# EAGLE design keypad connector (EAGLE 8.2.1)
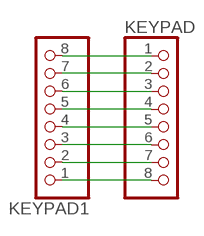
[diagram p0: schematic, sheet 1]

## Parts
KEYPAD  PINHD-1X8  [1X08]
KEYPAD1  PINHD-1X8  [1X08]

## Nets
N$1: KEYPAD1.8 KEYPAD.1
N$2: KEYPAD1.7 KEYPAD.2
N$3: KEYPAD1.6 KEYPAD.3
N$4: KEYPAD1.5 KEYPAD.4
N$5: KEYPAD1.4 KEYPAD.5
N$6: KEYPAD1.3 KEYPAD.6
N$7: KEYPAD1.2 KEYPAD.7
N$8: KEYPAD1.1 KEYPAD.8

## Library data of the parts
KEYPAD KEYPAD1 = pinhead:PINHD-1X8: PIN HEADER

## Board
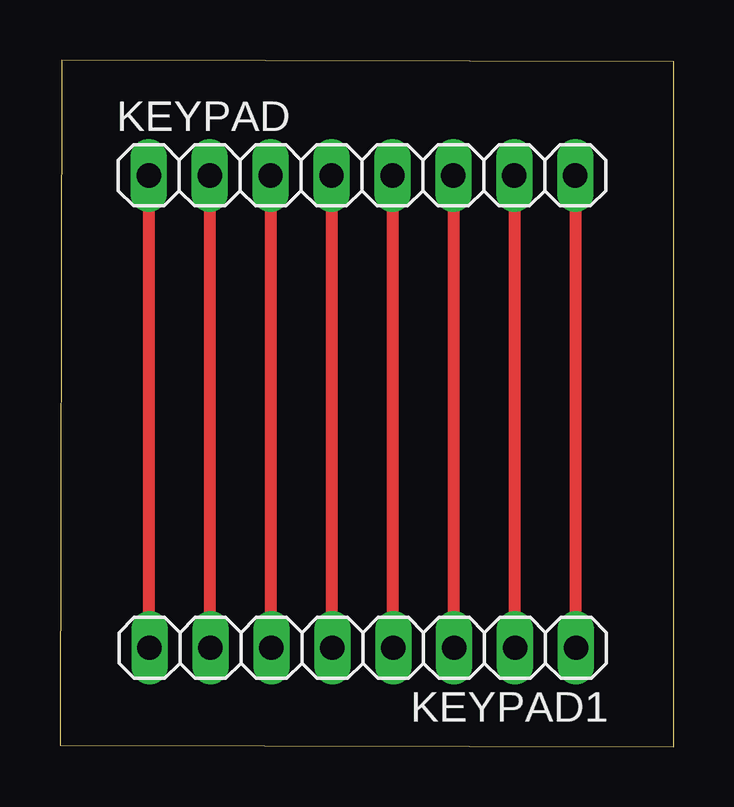
[diagram p1: board, top side]

Size 25.6 x 28.62 mm. Coordinates in mm from the lower left corner, seen from the top.
Outline: 0,0.07 25.6,0 25.59,28.54 0.07,28.62 0,0.07
Copper layers (1*16): Top 0.035mm / dielectric 1.5mm / Bottom 0.035mm
Design rules "default *": minimum track width 12mil, minimum drill 24mil, track to track 16mil, track to pad 16mil, pad to pad 16mil, via to via 16mil, smd to smd 16mil, copper to edge 40mil, drill to drill 8mil, minimum pad ring 10mil, minimum via ring 8mil, stop-mask expansion 4mil, vias tented up to drill 0mil, thermal gap 10mil

### Footprints (pad centres in the part's own frame; a part is rotated, then mirrored left to right if it is on the bottom)
1X08 = drill 1.016 long: 1 -8.89,0; 2 -6.35,0; 3 -3.81,0; 4 -1.27,0; 5 1.27,0; 6 3.81,0; 7 6.35,0; 8 8.89,0

### Placement (x,y rotation side)
KEYPAD  12.59,23.81 0 top
KEYPAD1  12.63,4.12 180 top

### Tracks (layer width: path | path; a pad name or v marks a point on that pad's centre or on a via)
N$1
  Top 0.508: KEYPAD.1 3.7,4.16 KEYPAD1.8
N$2
  Top 0.508: KEYPAD.2 6.24,4.16 KEYPAD1.7
N$3
  Top 0.508: KEYPAD.3 8.78,4.16 KEYPAD1.6
N$4
  Top 0.508: KEYPAD.4 11.32,4.16 KEYPAD1.5
N$5
  Top 0.508: KEYPAD.5 13.86,4.16 KEYPAD1.4
N$6
  Top 0.508: KEYPAD.6 16.4,4.16 KEYPAD1.3
N$7
  Top 0.508: KEYPAD.7 18.94,4.16 KEYPAD1.2
N$8
  Top 0.508: KEYPAD.8 21.48,4.16 KEYPAD1.1